# Altium schematic sheet VNA_2.SchDoc: VNA
size 409 x 289 mm; Origin: Eagle; OriginPath: C:\Users\Ground Lab\Desktop\LibreVNA\Hardware\Eagle\VNA.sch; OriginSheet: 3; OriginDescription: Source; Date: 04.05.2025 20:03:37; SheetNumber: 3; GateName_1: G$1; SymbolName_1: A3L-LOC; LibraryName: VNA; DeviceSetName: A3L-LOC; Sheet: Sheet:
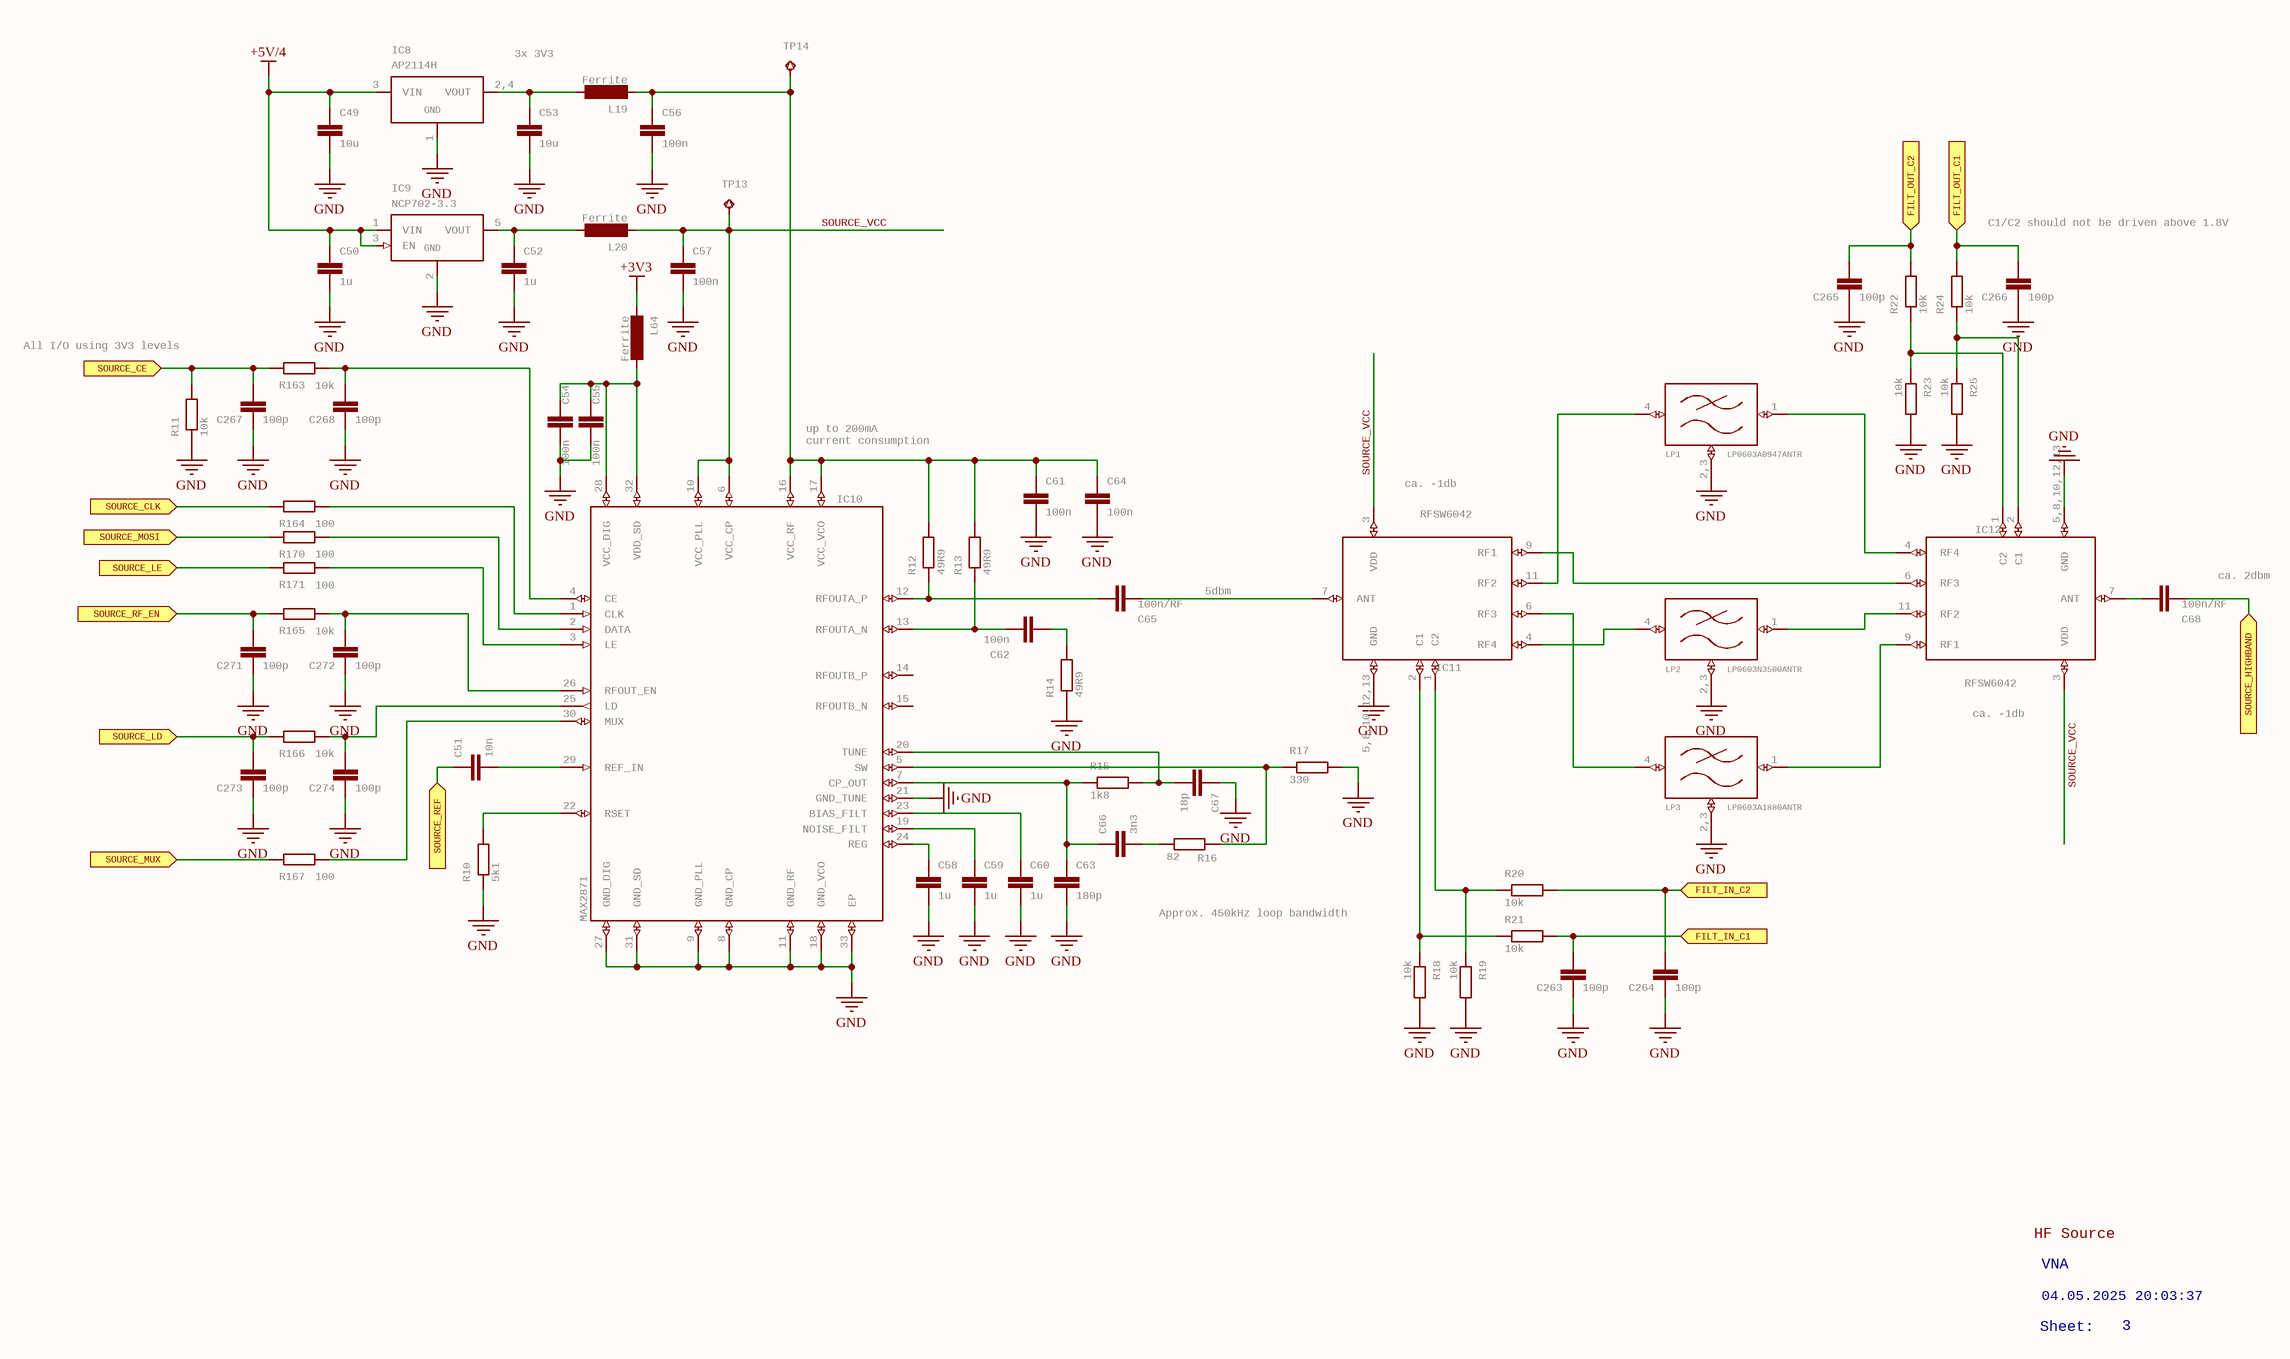
[diagram p0: VNA_2.SchDoc]

## Parts
C49  10u  [C1206]
C50  1u  [C0603]
C51  10n  [C0402]
C52  1u  [C0603]
C53  10u  [C1206]
C54  100n  [C0402]
C55  100n  [C0402]
C56  100n  [C0402]
C57  100n  [C0402]
C58  1u  [C0402]
C59  1u  [C0402]
C60  1u  [C0402]
C61  100n  [C0402]
C62  100n  [C0402]
C63  180p  [C0402]
C64  100n  [C0402]
C65  100n/RF  [C0402]
C66  3n3  [C0402]
C67  18p  [C0402]
C68  100n/RF  [C0402]
C263  100p  [C0402]
C264  100p  [C0402]
C265  100p  [C0402]
C266  100p  [C0402]
C267  100p  [C0402]
C268  100p  [C0402]
C271  100p  [C0402]
C272  100p  [C0402]
C273  100p  [C0402]
C274  100p  [C0402]
IC8  AP2114H  [SOT230P700X180-4]
IC9  NCP702-3.3  [SOT95P240X110-5]
IC10  MAX2871  [QFN50P500X500X80-33T310]
IC11  RFSW6042  [QFN40P180X180X55-13T76N]
IC12  RFSW6042  [QFN40P180X180X55-13T76N]
L19  Ferrite  [R0402]
L20  Ferrite  [R0402]
L64  Ferrite  [R0402]
LP1  LP0603A0947ANTR  [FILTRDFN160X84X70-4N]
LP2  LP0603N3500ANTR  [FILTRDFN160X84X70-4N]
LP3  LP0603A1880ANTR  [FILTRDFN160X84X70-4N]
R10  5k1  [R0402]
R11  10k  [R0402]
R12  49R9  [R0402]
R13  49R9  [R0402]
R14  49R9  [R0402]
R15  1k8  [R0402]
R16  82  [R0402]
R17  330  [R0402]
R18  10k  [R0402]
R19  10k  [R0402]
R20  10k  [R0402]
R21  10k  [R0402]
R22  10k  [R0402]
R23  10k  [R0402]
R24  10k  [R0402]
R25  10k  [R0402]
R163  10k  [R0402]
R164  100  [R0402]
R165  10k  [R0402]
R166  10k  [R0402]
R167  100  [R0402]
R170  100  [R0402]
R171  100  [R0402]
TP13  TPB1,27  [B1,27]  (value not drawn)
TP14  TPB1,27  [B1,27]  (value not drawn)

## Ports
FILT_IN_C1 (in), FILT_IN_C2 (in), FILT_OUT_C1 (in), FILT_OUT_C2 (in), SOURCE_CE (in), SOURCE_CLK (in), SOURCE_HIGHBAND (in), SOURCE_LD (in), SOURCE_LE (in), SOURCE_MOSI (in), SOURCE_MUX (in), SOURCE_REF (in), SOURCE_RF_EN (in)

## Nets
+3V3: L64.2
+5V/4: C49.1 C50.1 IC8.3(VIN) IC9.1(VIN) IC9.3(EN)
GND: C49.2 C50.2 C52.2 C53.2 C54.2 C55.2 C56.2 C57.2 C58.2 C59.2 C60.2 C61.2 C63.2 C64.2 C67.1 C263.2 C264.2 C265.2 C266.2 C267.2 C268.2 C271.2 C272.2 C273.2 C274.2 IC8.1(GND) IC9.2(GND) IC10.8(GND_CP) IC10.9(GND_PLL) IC10.11(GND_RF) IC10.18(GND_VCO) IC10.21(GND_TUNE) IC10.27(GND_DIG) IC10.31(GND_SD) IC10.33(EP) IC11.5,8,10,12,13(GND) IC12.5,8,10,12,13(GND) LP1.2,3(GND) LP2.2,3(GND) LP3.2,3(GND) R10.1 R11.1 R14.1 R17.2 R18.2 R19.2 R23.2 R25.2
FILT_IN_C1: C263.1 R21.2 ; port FILT_IN_C1
FILT_IN_C2: C264.1 R20.2 ; port FILT_IN_C2
FILT_OUT_C1: C266.1 R24.2 ; port FILT_OUT_C1
FILT_OUT_C2: C265.1 R22.2 ; port FILT_OUT_C2
SOURCE_CE: C267.1 R11.2 R163.2 ; port SOURCE_CE
SOURCE_CLK: R164.2 ; port SOURCE_CLK
SOURCE_HIGHBAND: C68.2 ; port SOURCE_HIGHBAND
SOURCE_LD: C273.1 R166.2 ; port SOURCE_LD
SOURCE_LE: R171.2 ; port SOURCE_LE
SOURCE_MOSI: R170.2 ; port SOURCE_MOSI
SOURCE_MUX: R167.2 ; port SOURCE_MUX
SOURCE_REF: C51.1 ; port SOURCE_REF
SOURCE_RF_EN: C271.1 R165.2 ; port SOURCE_RF_EN
SOURCE_VCC: C57.1 IC10.6(VCC_CP) IC10.10(VCC_PLL) IC11.3(VDD) IC12.3(VDD) L20.2 TP13.TP
NetC51_2: C51.2 IC10.29(REF_IN)
NetC52_1: C52.1 IC9.5(VOUT) L20.1
NetC53_1: C53.1 IC8.2,4(VOUT) L19.1
NetC54_1: C54.1 C55.1 IC10.28(VCC_DIG) IC10.32(VDD_SD) L64.1
NetC56_1: C56.1 C61.1 C64.1 IC10.16(VCC_RF) IC10.17(VCC_VCO) L19.2 R12.2 R13.2 TP14.TP
NetC58_1: C58.1 IC10.24(REG)
NetC59_1: C59.1 IC10.19(NOISE_FILT)
NetC60_1: C60.1 IC10.23(BIAS_FILT)
NetC62_1: C62.1 R14.2
NetC62_2: C62.2 IC10.13(RFOUTA_N) R13.1
NetC63_1: C63.1 C66.1 IC10.7(CP_OUT) R15.1
NetC65_1: C65.1 IC10.12(RFOUTA_P) R12.1
NetC65_2: C65.2 IC11.7(ANT)
NetC66_2: C66.2 R16.1
NetC67_2: C67.2 IC10.20(TUNE) R15.2
NetC68_1: C68.1 IC12.7(ANT)
NetC268_1: C268.1 IC10.4(CE) R163.1
NetC272_1: C272.1 IC10.26(RFOUT_EN) R165.1
NetC274_1: C274.1 IC10.25(LD) R166.1
NetIC10_1: IC10.1(CLK) R164.1
NetIC10_2: IC10.2(DATA) R170.1
NetIC10_3: IC10.3(LE) R171.1
NetIC10_5: IC10.5(SW) R16.2 R17.1
NetIC10_22: IC10.22(RSET) R10.2
NetIC10_30: IC10.30(MUX) R167.1
NetIC11_1: IC11.1(C2) R19.1 R20.1
NetIC11_2: IC11.2(C1) R18.1 R21.1
NetIC11_4: IC11.4(RF4) LP2.4(IN)
NetIC11_6: IC11.6(RF3) LP3.4(IN)
NetIC11_9: IC11.9(RF1) IC12.6(RF3)
NetIC11_11: IC11.11(RF2) LP1.4(IN)
NetIC12_1: IC12.1(C2) IC12.2(C1) R22.1 R23.1 R24.1 R25.1
NetIC12_4: IC12.4(RF4) LP1.1(OUT)
NetIC12_9: IC12.9(RF1) LP3.1(OUT)
NetIC12_11: IC12.11(RF2) LP2.1(OUT)

Not connected (* = marked no-connect by the designer): IC10 14(RFOUTB_P) 15(RFOUTB_N)

## Notes on the sheet
- 3x 3V3
- C1/C2 should not be driven above 1.8V
- (near R11) All I/O using 3V3 levels
- up to 200mA
  current consumption
- (near IC11) ca. -1db
- 5dbm
- (near C68) ca. 2dbm
- (near IC12) ca. -1db
- Approx. 450kHz loop bandwidth
- HF Source
- VNA
- Sheet:
- 04.05.2025 20:03:37
- 3

## Library data of the parts
C49 C53 = C-EUC1206: CAPACITOR, European symbol; GateName_1: G$1; SymbolName_1: C-EU; DeviceName: C1206; LibraryName: VNA; DeviceSetName: C-EU
C50 C52 = C-EU*?:1C0603: CAPACITOR, European symbol; GateName_1: G$1; SymbolName_1: C-EU-1; DeviceName: C0603; LibraryName: VNA; DeviceSetName: C-EU*?:1
C51 C54-C68 C263-C268 C271-C274 = C-EU*?:2C0402: CAPACITOR, European symbol; GateName_1: G$1; SymbolName_1: C-EU:1; DeviceName: C0402; LibraryName: VNA; DeviceSetName: C-EU*?:2
IC8 = AP2114H: GateName_1: G$1; SymbolName_1: VREG; DeviceName: H; DeviceSetName: AP2114; LibraryName: VNA; GND: GND
IC9 = NCP702: GateName_1: G$1; SymbolName_1: VREG_EN; LibraryName: VNA; DeviceSetName: NCP702; GND: GND
IC10 = MAX2871: GateName_1: G$1; SymbolName_1: MAX2871; LibraryName: VNA; DeviceSetName: MAX2871
IC11 IC12 = RFSW6042: GateName_1: G$1; SymbolName_1: RFSW6042; LibraryName: VNA; DeviceSetName: RFSW6042
L19 L20 L64 = FERRITE: GateName_1: G$1; SymbolName_1: L-EU:1; LibraryName: VNA; DeviceSetName: FERRITE
LP1-LP3 = LP0603A: GateName_1: G$1; SymbolName_1: LOWPASS; LibraryName: VNA; DeviceSetName: LP0603A
R10-R25 R163-R167 R170 R171 = R-EU_R0402: RESISTOR, European symbol; GateName_1: G$1; SymbolName_1: R-EU; DeviceSetName: R-EU_; DeviceName: R0402; LibraryName: VNA
TP13 TP14 = TPB1,27: Test pad; GateName_1: G$1; SymbolName_1: TP; DeviceName: B1,27; LibraryName: VNA; DeviceSetName: TP